# EAGLE design SparkFun_Coin_Cell_Battery_Holder-24.5mm (EAGLE 7.2.0)
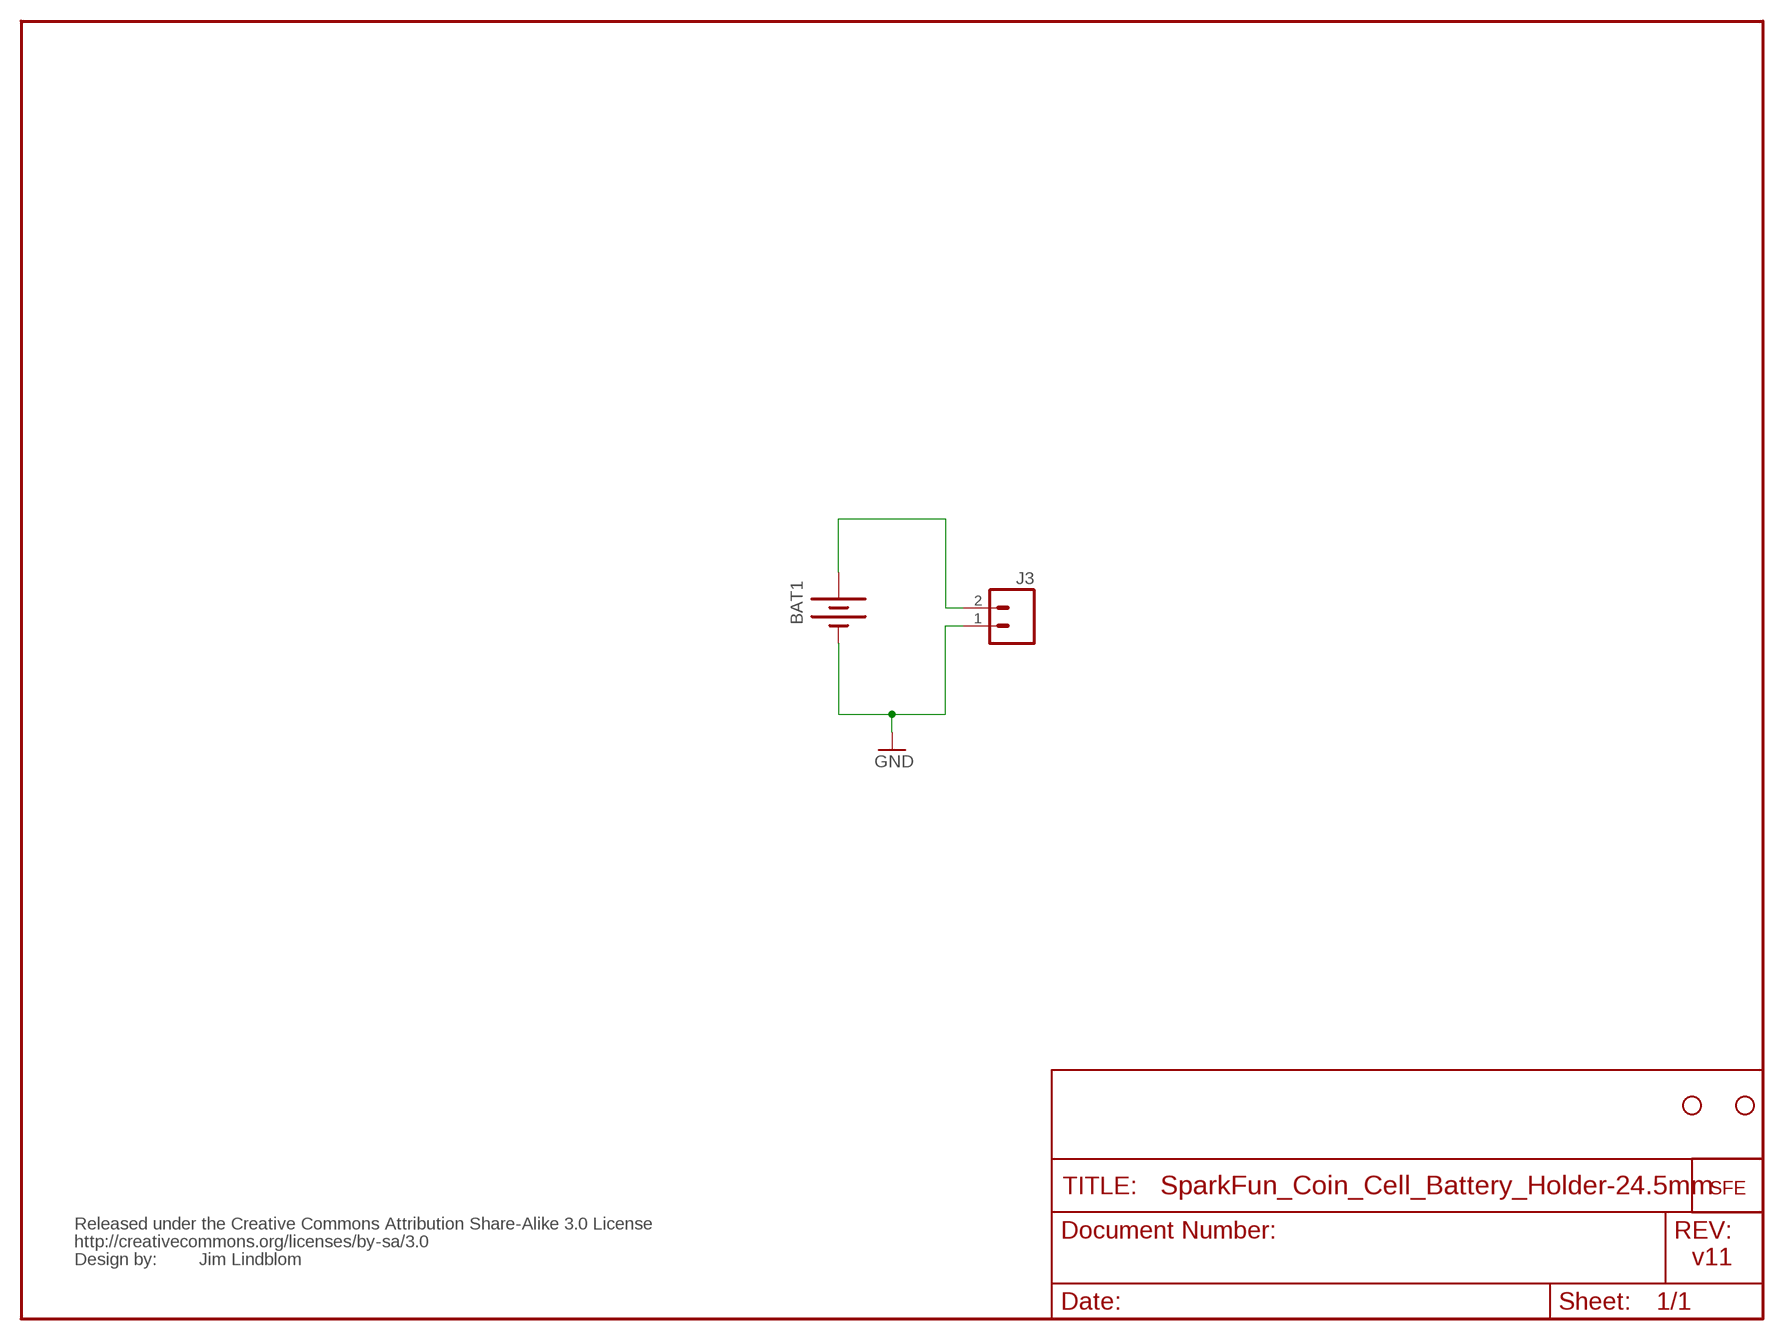
[diagram p0: schematic, sheet 1]

## Parts
BAT1  BATTERY245PTH  [BATTCON_245MM_PTH]
J3  M02PTH  [1X02]
JP2  LOGO-SFENEW  [SFE-NEW-WEBLOGO]
JP4  STAND-OFF  [STAND-OFF]
JP5  STAND-OFF  [STAND-OFF]
U$1  CREATIVE_COMMONS  [CREATIVE_COMMONS]

## Nets
GND: BAT1.2(-) J3.1
J2: BAT1.3(+) J3.2

## Notes on the sheet
- Jim Lindblom | v11

## Library data of the parts
BAT1 = SparkFun:BATTERY: Battery Holders Various common sizes : AA, AAA, 20mm coin cell and 12mm coin cell.
J3 = SparkFun:M02: Header 2 Standard 2-pin 0.1" header. Use with straight break away headers (SKU : PRT-00116), right angle break away headers (PRT-00553), swiss pins (PRT-00743), machine pins (PRT-00117), and female headers (PRT-00115). Molex polarized connector foot print use with SKU : PRT-08233 with associated crimp pins and housings.
JP2 = SparkFun:LOGO-SFE: Spark Fun Electronics PCB Logo This is the standard Spark Fun Electronics PCB logo.
JP4 JP5 = SparkFun:STAND-OFF: Stand Off This is the mechanical footprint for a #4 phillips button head screw. Use the keepout ring to avoid running the screw head into surrounding components. SKU : PRT-00447
U$1 = SparkFun:CREATIVE_COMMONS

## Board
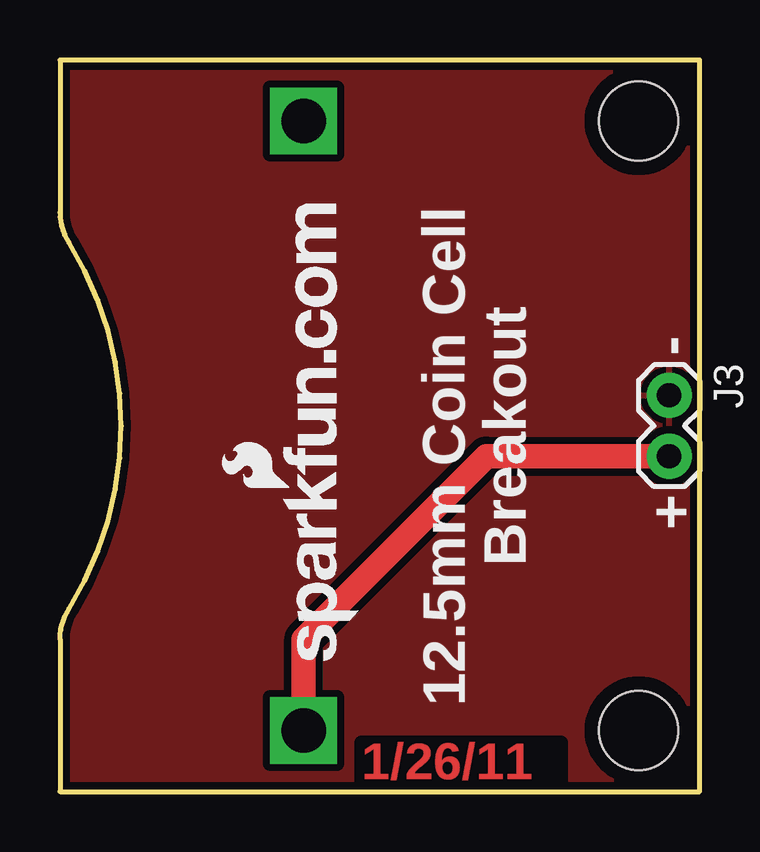
[diagram p1: board, top side]
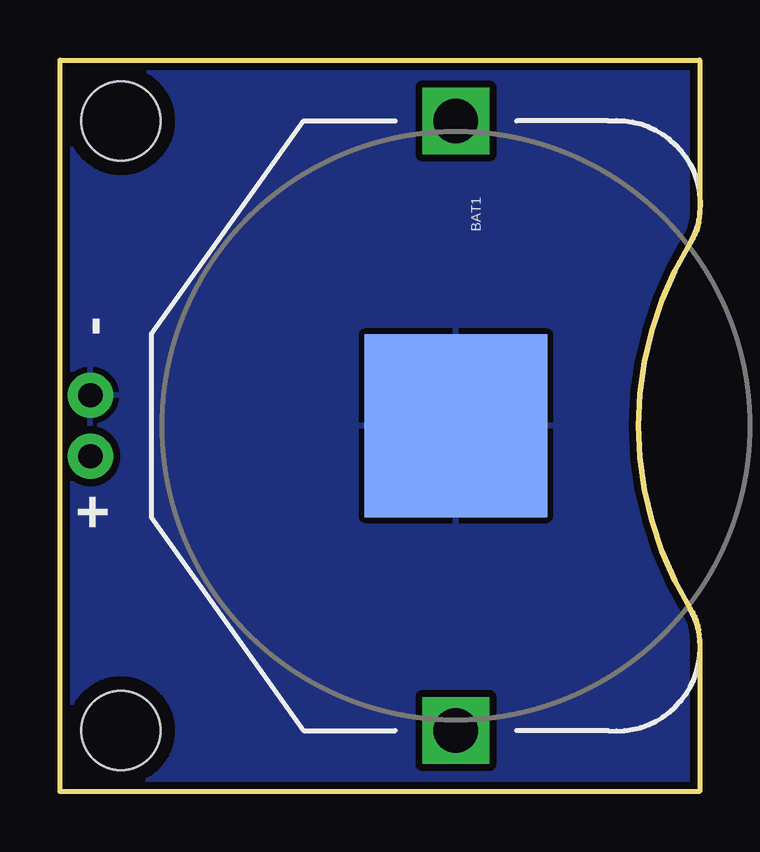
[diagram p2: board, bottom side, seen from below]

Size 26.67 x 30.48 mm. Coordinates in mm from the lower left corner, seen from the top.
Outline: 0,0 26.67,0 26.67,30.48 0,30.48 0,24.13 arc33 0.38,22.86 arc-64 0.38,7.62 arc33 0,6.35 0,0
Copper layers (1*16): Top 0.035mm / dielectric 1.5mm / Bottom 0.035mm
Design rules "SparkFun": minimum track width 8mil, minimum drill 20mil, track to track 8mil, track to pad 8mil, pad to pad 8mil, via to via 8mil, smd to smd 8mil, copper to edge 8mil, drill to drill 8mil, minimum pad ring 12mil, minimum via ring 10mil, stop-mask expansion 4mil, vias tented up to drill 20mil, thermal gap 10mil

### Footprints (pad centres in the part's own frame; a part is rotated, then mirrored left to right if it is on the bottom)
BATTCON_245MM_PTH = drill 1.854 square: 1 -12.7,0; 3 12.7,0 | smd 7.62 x 7.62: 2 0,0
1X02 = drill 1.016 pad 1.88: 1 0,0; 2 2.54,0
STAND-OFF = hole 3.302: 0,0

### Placement (x,y rotation side)
BAT1  10.16,15.24 270 bottom
J3  25.4,16.51 270 top
JP2  12.45,5.46 90 top
JP4  24.13,2.54 0 top
JP5  24.13,27.94 0 top
U$1  -1.27,-12.7 0 top  (outside the outline)

### Tracks (layer width: path | path; a pad name or v marks a point on that pad's centre or on a via)
GND
  pour Bottom (isolate 0.305): 0,30.48 0,0 26.67,0 26.67,30.48
  pour Top (isolate 0.305): 0,30.48 0,0 26.67,0 26.67,30.48
J2
  Top 1.016: BAT1.3 10.16,6.35 17.78,13.97 J3.2

### Text on the board
Top: 1/26/11
tPlace: - | + | Breakout | 12.5mm Coin Cell
bPlace: - | +